# Altium schematic sheet rev02_8.SchDoc
size 409 x 282 mm
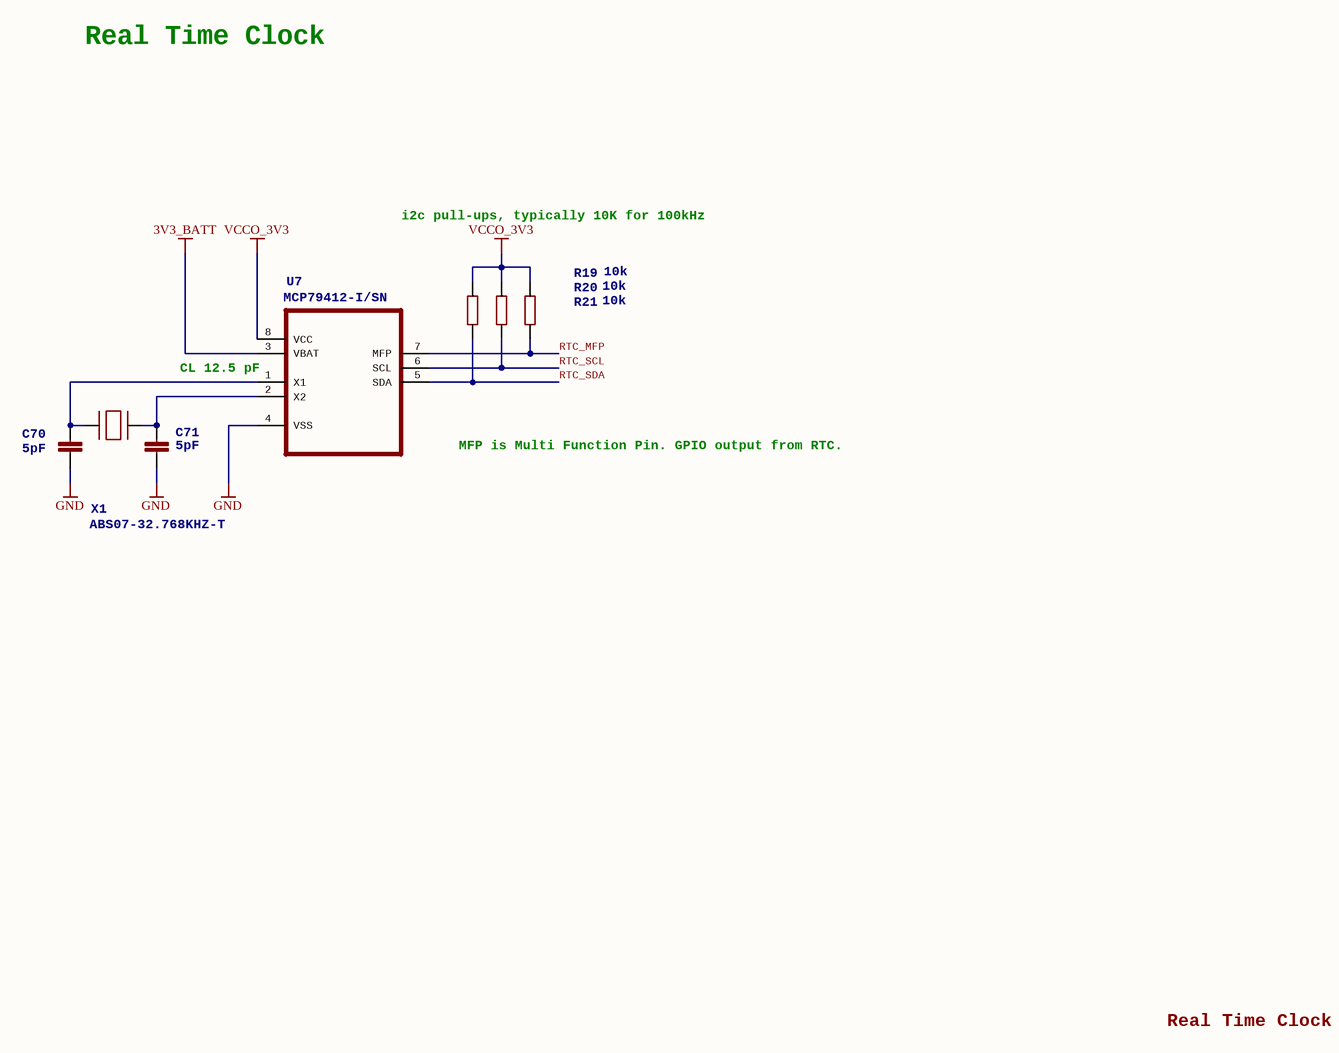
[diagram p0: rev02_8.SchDoc]

## Parts
C70  value 5pF  [C_0402]
C71  value 5pF  [C_0402]
R19  value 10k  [R_0402]
R20  value 10k  [R_0402]
R21  value 10k  [R_0402]
U7  MCP79412-I/SN  >NAME: U7  [SOIC127P600X175-8N]
X1  ABS07-32.768KHZ-T  >NAME: X1  [XTAL3215]

## Nets
3V3_BATT: U7.3(VBAT)
GND: C70.1 C71.1 U7.4(VSS)
VCCO_3V3: R19.1 R20.1 R21.1 U7.8(VCC)
RTC_MFP: R21.2 U7.7(MFP)
RTC_SCL: R20.2 U7.6(SCL)
RTC_SDA: R19.2 U7.5(SDA)
NetC70_2: C70.2 U7.1(X1) X1.P$1
NetC71_2: C71.2 U7.2(X2) X1.P$2

## Notes on the sheet
- Real Time Clock
- i2c pull-ups, typically 10K for 100kHz
- (near U7) CL 12.5 pF
- MFP is Multi Function Pin.
  GPIO output from RTC.

## Library data of the parts
C70 C71 = C-EUC0402: 0402 CAPACITOR
R19-R21 = R-EU_R0402: 0402 Resistor 5%
U7 = MCP79412-I/SN: RTCC, I2C, 1K EE, 64B SRAM, 8SOIC; MPN: MCP79412-I/SN; OC_FARNELL: 2103565; OC_NEWARK: 94T5863; PACKAGE: SOIC-8; SUPPLIER: Microchip; >VALUE: MCP79412-I/SN
X1 = XTAL-3.2X1.5: Crystal 32.768kHz; MPN: ABS07-32.768KHZ-T; OC_FARNELL: 2101347; >VALUE: XTAL-3.2X1.5